# EAGLE design ds_atmega168 (EAGLE 4.16)
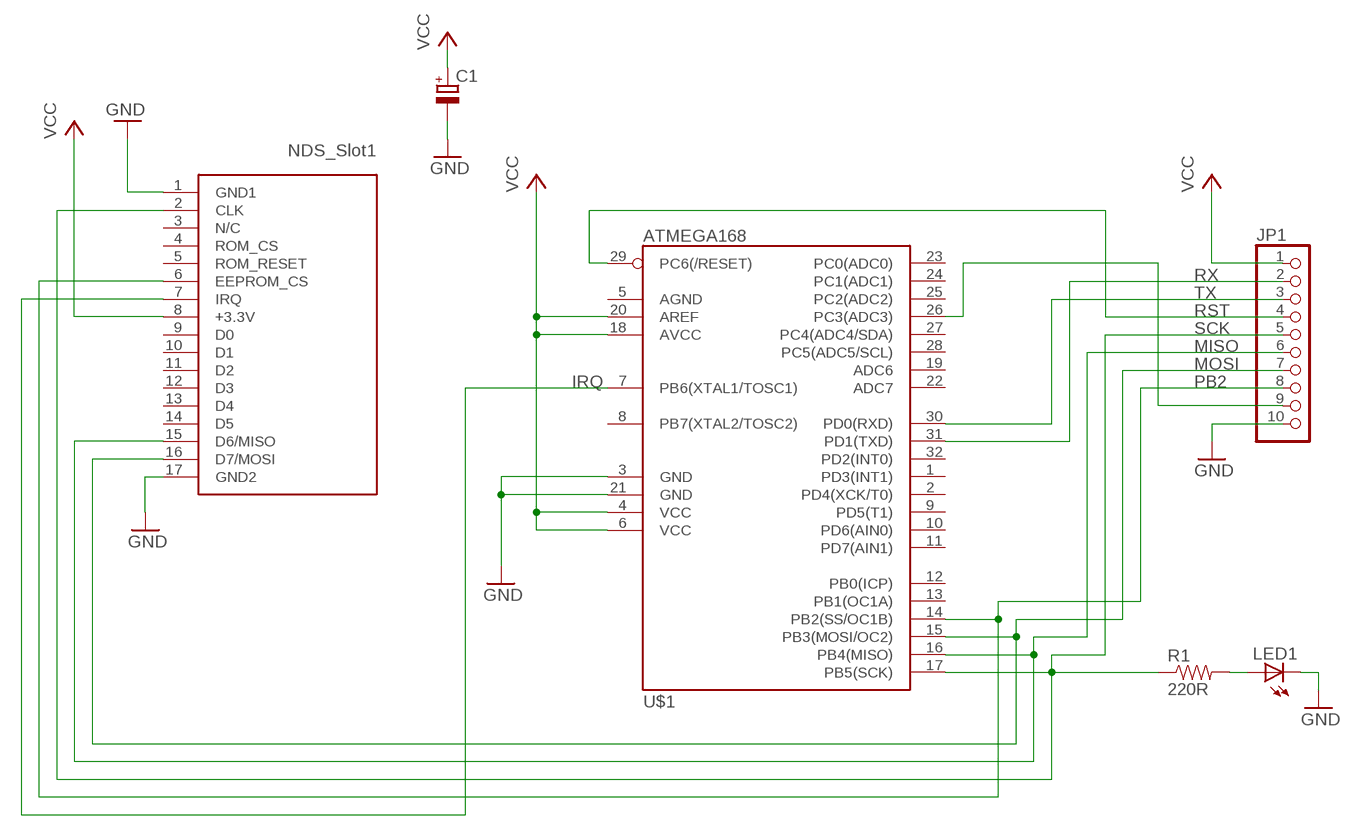
[diagram p0: schematic, sheet 1]

## Parts
C1  CPOL-EUSMCA  [SMC_A]
JP1  PINHD-1X10  [1X10]
LED1  LED0603  [LED-0603]
R1  220R  RESISTOR1206  [1206]
U$1  ATMEGA168  [TQFP32-08]
U$2  M3_CARTRIDGE  [M3_CARTRIDGE]

## Nets
GND: C1.- JP1.10 LED1.C U$1.3(GND) U$1.21(GND) U$2.1(GND1) U$2.17(GND2)
N$1: JP1.3 U$1.30(PD0(RXD))
N$2: JP1.5 R1.1 U$1.17(PB5(SCK)) U$2.2(CLK)
N$3: JP1.9 U$1.26(PC3(ADC3))
N$4: LED1.A R1.2
N$5: JP1.2 U$1.31(PD1(TXD))
N$6: JP1.8 U$1.14(PB2(SS/OC1B)) U$2.6(EEPROM_CS)
N$7: JP1.4 U$1.29(PC6(/RESET))
N$8: JP1.6 U$1.16(PB4(MISO)) U$2.15(D6/MISO)
N$9: JP1.7 U$1.15(PB3(MOSI/OC2)) U$2.16(D7/MOSI)
N$13: U$1.7(PB6(XTAL1/TOSC1)) U$2.7(IRQ)
VCC: C1.+ JP1.1 U$1.4(VCC) U$1.6(VCC) U$1.18(AVCC) U$1.20(AREF) U$2.8(+3.3V)
Unconnected: U$1.1(PD3(INT1)) U$1.2(PD4(XCK/T0)) U$1.5(AGND) U$1.8(PB7(XTAL2/TOSC2)) U$1.9(PD5(T1)) U$1.10(PD6(AIN0)) U$1.11(PD7(AIN1)) U$1.12(PB0(ICP)) U$1.13(PB1(OC1A)) U$1.19(ADC6) U$1.22(ADC7) U$1.23(PC0(ADC0)) U$1.24(PC1(ADC1)) U$1.25(PC2(ADC2)) U$1.27(PC4(ADC4/SDA)) U$1.28(PC5(ADC5/SCL)) U$1.32(PD2(INT0)) U$2.3(N/C) U$2.4(ROM_CS) U$2.5(ROM_RESET) U$2.9(D0) U$2.10(D1) U$2.11(D2) U$2.12(D3) U$2.13(D4) U$2.14(D5)

## Notes on the sheet
- RX
- TX
- RST
- SCK
- MISO
- MOSI
- IRQ | PB2

## Library data of the parts
C1 = rcl:CPOL-EU: POLARIZED CAPACITOR, European symbol
JP1 = pinhead:PINHD-1X10: PIN HEADER
LED1 = SparkFunEagle-6-6-07:LED: LEDs Standard schematic elements and footprints for 5mm, 3mm, 1206, and 0603 sized LEDs. 5mm - Spark Fun Electronics SKU : COM-00529 (and others)
R1 = SparkFunEagle-6-6-07:RESISTOR: Resistor Basic schematic elements and footprints for 0603, 1206, and PTH 1/10th watt (small) resistors.
U$1 = SparkFunEagle-6-6-07:ATMEGA168
U$2 = nds_cart1:M3_CARTRIDGE

## Board
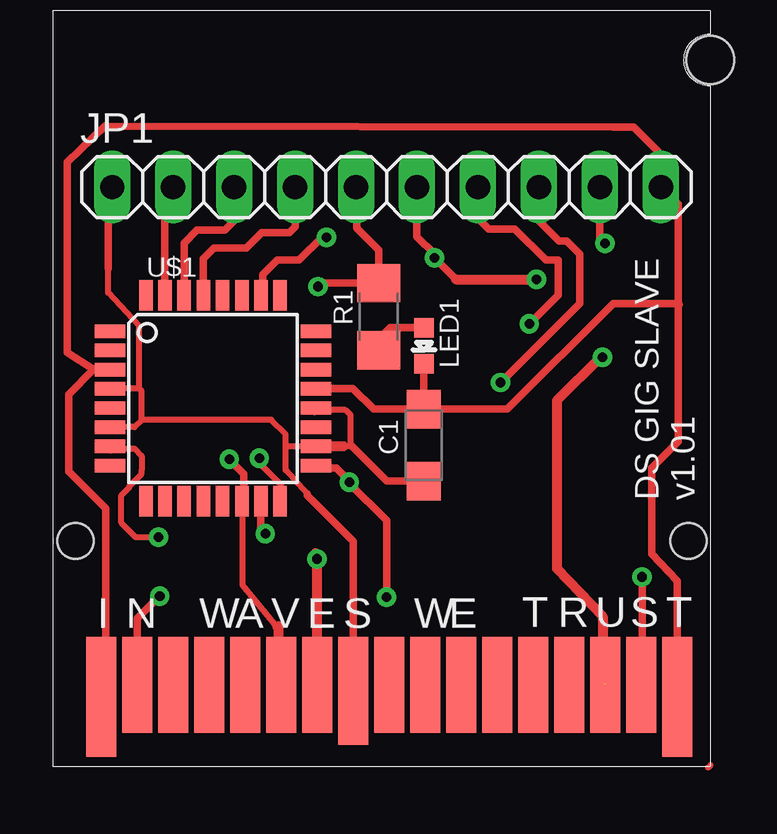
[diagram p1: board, top side]
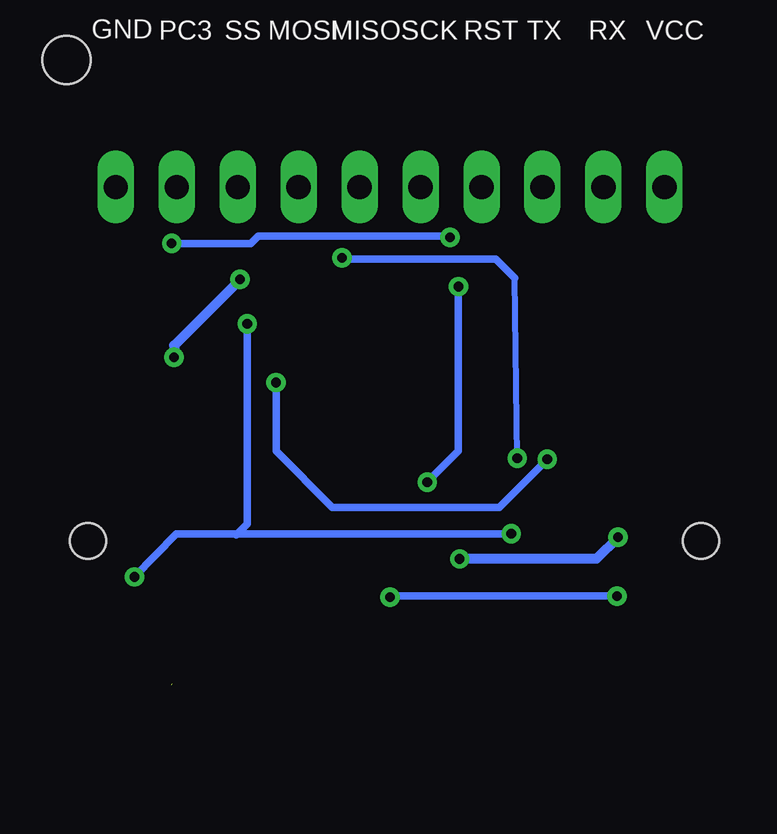
[diagram p2: board, bottom side, seen from below]

No outline drawn. Coordinates in mm, seen from the top.
Copper layers (1*16): Top 0.035mm / dielectric 1.5mm / Bottom 0.035mm
Design rules "default": minimum track width 10mil, minimum drill 24mil, track to track 8mil, track to pad 8mil, pad to pad 8mil, via to via 8mil, smd to smd 8mil, copper to edge 40mil, drill to drill 8mil, minimum pad ring 10mil, minimum via ring 8mil, stop-mask expansion 4mil, vias tented up to drill 0mil, thermal gap 10mil

### Footprints (pad centres in the part's own frame; a part is rotated, then mirrored left to right if it is on the bottom)
SMC_A = smd 1.6 x 1.4: + -1.5,0; - 1.5,0
1X10 = drill 1.016 long: 1 -11.43,0; 2 -8.89,0; 3 -6.35,0; 4 -3.81,0; 5 -1.27,0; 6 1.27,0; 7 3.81,0; 8 6.35,0; 9 8.89,0; 10 11.43,0
LED-0603 = smd 0.8 x 0.8: A 0,-0.75; C 0,0.75
1206 = smd 1.6 x 1.8: 1 -1.4,0; 2 1.4,0
TQFP32-08 = smd 1.27 x 0.559: 1 -4.293,2.8; 2 -4.293,2; 3 -4.293,1.2; 4 -4.293,0.4; 5 -4.293,-0.4; 6 -4.293,-1.2; 7 -4.293,-2; 8 -4.293,-2.8; 17 4.293,-2.8; 18 4.293,-2; 19 4.293,-1.2; 20 4.293,-0.4; 21 4.293,0.4; 22 4.293,1.2; 23 4.293,2; 24 4.293,2.8 | smd 0.559 x 1.27: 9 -2.8,-4.293; 10 -2,-4.293; 11 -1.2,-4.293; 12 -0.4,-4.293; 13 0.4,-4.293; 14 1.2,-4.293; 15 2,-4.293; 16 2.8,-4.293; 25 2.8,4.293; 26 2,4.293; 27 1.2,4.293; 28 0.4,4.293; 29 -0.4,4.293; 30 -1.2,4.293; 31 -2,4.293; 32 -2.8,4.293
M3_CARTRIDGE = smd 1.25 x 5: 1 1.975,3; 17 25.975,3 | smd 1.25 x 4: 2 3.475,3.5; 3 4.975,3.5; 4 6.475,3.5; 5 7.975,3.5; 6 9.475,3.5; 7 10.975,3.5; 9 13.975,3.5; 10 15.475,3.5; 11 16.975,3.5; 12 18.475,3.5; 13 19.975,3.5; 14 21.475,3.5; 15 22.975,3.5; 16 24.475,3.5 | smd 1.25 x 4.5: 8 12.475,3.25 | hole 1.5: 0.9,9.5; 26.45,9.5 | hole 2: 27.35,29.55

### Placement (x,y rotation side)
C1  15.35,13.44 90 top
JP1  13.8,24.2 0 top
LED1  15.36,17.58 180 top
R1  13.48,18.8 270 top
U$1  6.57,15.39 0 top
U$2  -0.06,-0.05 0 top

### Tracks (layer width: path | path; a pad name or v marks a point on that pad's centre or on a via)
GND
  Top 0.305: U$2.17 25.91,7.79 24.85,8.9 24.85,12.5 25.95,13.6 25.95,19.3 | 15.38,16.83 15.45,16.9 | 15.38,16.83 LED1.C | C1.- 15.35,16.8 15.38,16.83 | C1.- 13.26,14.94 12.4,15.8 10.9,15.8 10.86,15.76 | 10.86,15.76 10.85,15.75 | 10.86,15.76 U$1.21 | C1.- 18.84,14.94 23.25,19.35 25.95,19.35 26,19.3 25.95,19.3 | 1.61,16.59 U$1.3 | 1.61,16.59 0.5,17.3 0.5,25.25 2.05,26.75 23.25,26.7 24.1,26.7 25.25,25.55 25.25,24.3 25.35,24.2 | 1.61,16.59 1.59,16.59 0.55,15.55 0.55,12.35 2.1,10.8 2.1,3.1 1.95,2.95 U$2.1 | 25.35,24.2 25.4,24.15 | 25.35,24.2 25.25,24.2 | 25.25,24.2 JP1.10 | 25.95,19.3 25.95,23.5 25.25,24.2
N$1
  Top 0.305: U$1.30 5.37,21.87 5.9,22.4 7.05,22.4 7.45,22.8 7.45,23.95 7.4,24 7.45,24.05 JP1.3
N$2  (via drill 0.4)
  Top 0.305: v10.95,20.05 11.1,20.2 R1.1 13.48,21.57 12.55,22.5 12.55,24.1 12.45,24.2 JP1.5 | U$1.17 10.91,12.59 11,12.5 11.7,12.5 12.25,11.95 v12.25,11.9 12.25,11.85 13.8,10.3 v13.8,7.1 | U$2.2 3.42,6.21 v4.35,7.15
  Bottom 0.305: v10.95,20.05 10.95,13.2 v12.25,11.9 | v4.35,7.15 13.75,7.15 v13.8,7.1
N$3  (via drill 0.4)
  Top 0.305: JP1.9 22.69,22.06 v22.9,21.85 | v11.3,22.1 11.1,22.1 10.15,21.15 9.25,21.15 8.65,20.55 8.65,19.55 8.6,19.5 8.57,19.53 U$1.26
  Bottom 0.305: v22.9,21.85 19.6,21.85 19.3,22.15 11.35,22.15 v11.3,22.1
N$4
  Top 0.305: R1.2 13.48,17.88 13.95,18.35 15.35,18.35 LED1.A
N$5
  Top 0.305: JP1.2 5,24.2 4.57,23.77 U$1.31
N$6  (via drill 0.4)
  Top 0.254: 9.35,5.75 9.25,5.85 7.8,7.6 7.8,11.1
  Top 0.305: v18.55,16.05 21.8,19.3 | v7.25,12.85 7.85,12.25 7.85,11 7.77,11.08 U$1.14 | JP1.8 20.15,22.8 21,21.95 21.3,21.95 21.85,21.4 21.85,19.35 21.8,19.3 | 21.8,19.3 21.81,19.31
  Top 0.406: 7.8,11.1 U$1.14 | 9.3,5.85 9.3,5.9 | 9.3,5.85 9.25,5.85 | U$2.6 9.3,3.45 9.3,5.85
  Bottom 0.305: v18.55,16.05 18.55,13.2 16.2,10.85 9.25,10.85 v7.25,12.85
N$7
  Top 0.305: U$1.29 6.17,21.22 6.6,21.65 7.95,21.65 8.6,22.3 9.75,22.3 10,22.55 10,24 9.95,24.05 9.99,24.09 JP1.4
N$8  (via drill 0.4)  (1 unrouted)
  Top 0.254: 9.4,11.1 9.4,11.8 8.5,12.7 v8.5,12.9
  Top 0.305: JP1.6 15.07,22.13 15.8,21.4 v15.8,21.25 16.7,20.35
  Top 0.406: 9.4,11.1 U$1.16 | 16.7,20.35 v20.05,20.35 | v22.8,17.1 22.7,17.1 20.9,15.3 20.9,8.3 22.8,6.3 22.8,3.6 22.9,3.5
  Bottom 0.254: v8.5,12.9 8.6,20.4
  Bottom 0.305: 8.6,20.4 9.4,21.2 15.75,21.2 v15.8,21.25
  Bottom 0.406: v22.8,17.1 22.8,17.6 v20.05,20.35
N$9  (via drill 0.4)
  Top 0.305: U$1.15 8.57,9.93 v8.75,9.75 | U$2.16 24.55,3.45 24.45,3.55 v24.45,7.95 | v19.75,18.5 20.95,19.7 20.95,21.15 20.45,21.15 19.15,22.45 18.05,22.45 17.6,22.9 JP1.7 | JP1.7 17.65,24.25 | JP1.7
  Bottom 0.305: v8.75,9.75 20.2,9.75 | 20.2,9.75 22.7,9.75 v24.45,7.95 | 20.2,9.75 20.2,9.7 19.75,10.15 v19.75,18.5
N$10
  Top 0.254: 27.3,0.1 27.2,0
N$13  (via drill 0.4)
  Top 0.25: 3.6,12.4 3.6,13 3.3,13.3 2.3,13.3
  Top 0.254: v4.3,9.6 3.35,9.6 2.75,10.2 2.75,11.35 3.1,11.7 3.1,11.75 3.6,12.25 3.6,12.4
  Top 0.406: 10.85,8.95 v10.9,8.7 U$2.7 | 2.3,13.3 2.28,13.32 U$1.7
  Bottom 0.406: v10.9,8.7 5.2,8.7 v4.3,9.6
VCC
  Top 0.254: 9.6,13.4 10.9,13.4 12.3,13.4 12.3,13.45 12.3,14.7 12.1,14.9 10.9,14.9 10.81,14.99 | 10.5,11.4 9.6,12.4 9.6,13.4 | 10.81,14.99 10.8,15 | 10.81,14.99 U$1.20 | U$1.6 3.29,14.19 3.6,14.5 | 3.6,14.5 3.6,15.7 3.5,15.8 | U$1.4 2.21,15.79 2.2,15.8 3.5,15.8 | 3.5,15.8 3.5,18.4 2.2,19.8 2.2,20.8 | 9.6,13.4 9.6,13.9 9,14.5 3.6,14.5
  Top 0.305: 10.5,11.4 10.5,11.35 12.41,9.44 U$2.8 | C1.+ 13.81,11.94 12.3,13.45 | JP1.1 2.37,24.18 2.4,24.15 2.2,23.95 2.2,20.8
  Top 0.406: 12,13.4 10.9,13.4 10.89,13.39 U$1.18 | 10.89,14.99 10.9,15 | U$1.20 10.89,14.99 | 10.89,14.99 10.8,14.9

### Text on the board
tPlace: DS GIG SLAVE | v1.01
bPlace: VCC | RX | TX | RST | SCK | MISO | MOSI | SS | PC3 | GND